# EAGLE schematic wordclock-r4-4x6 (EAGLE 5.11)
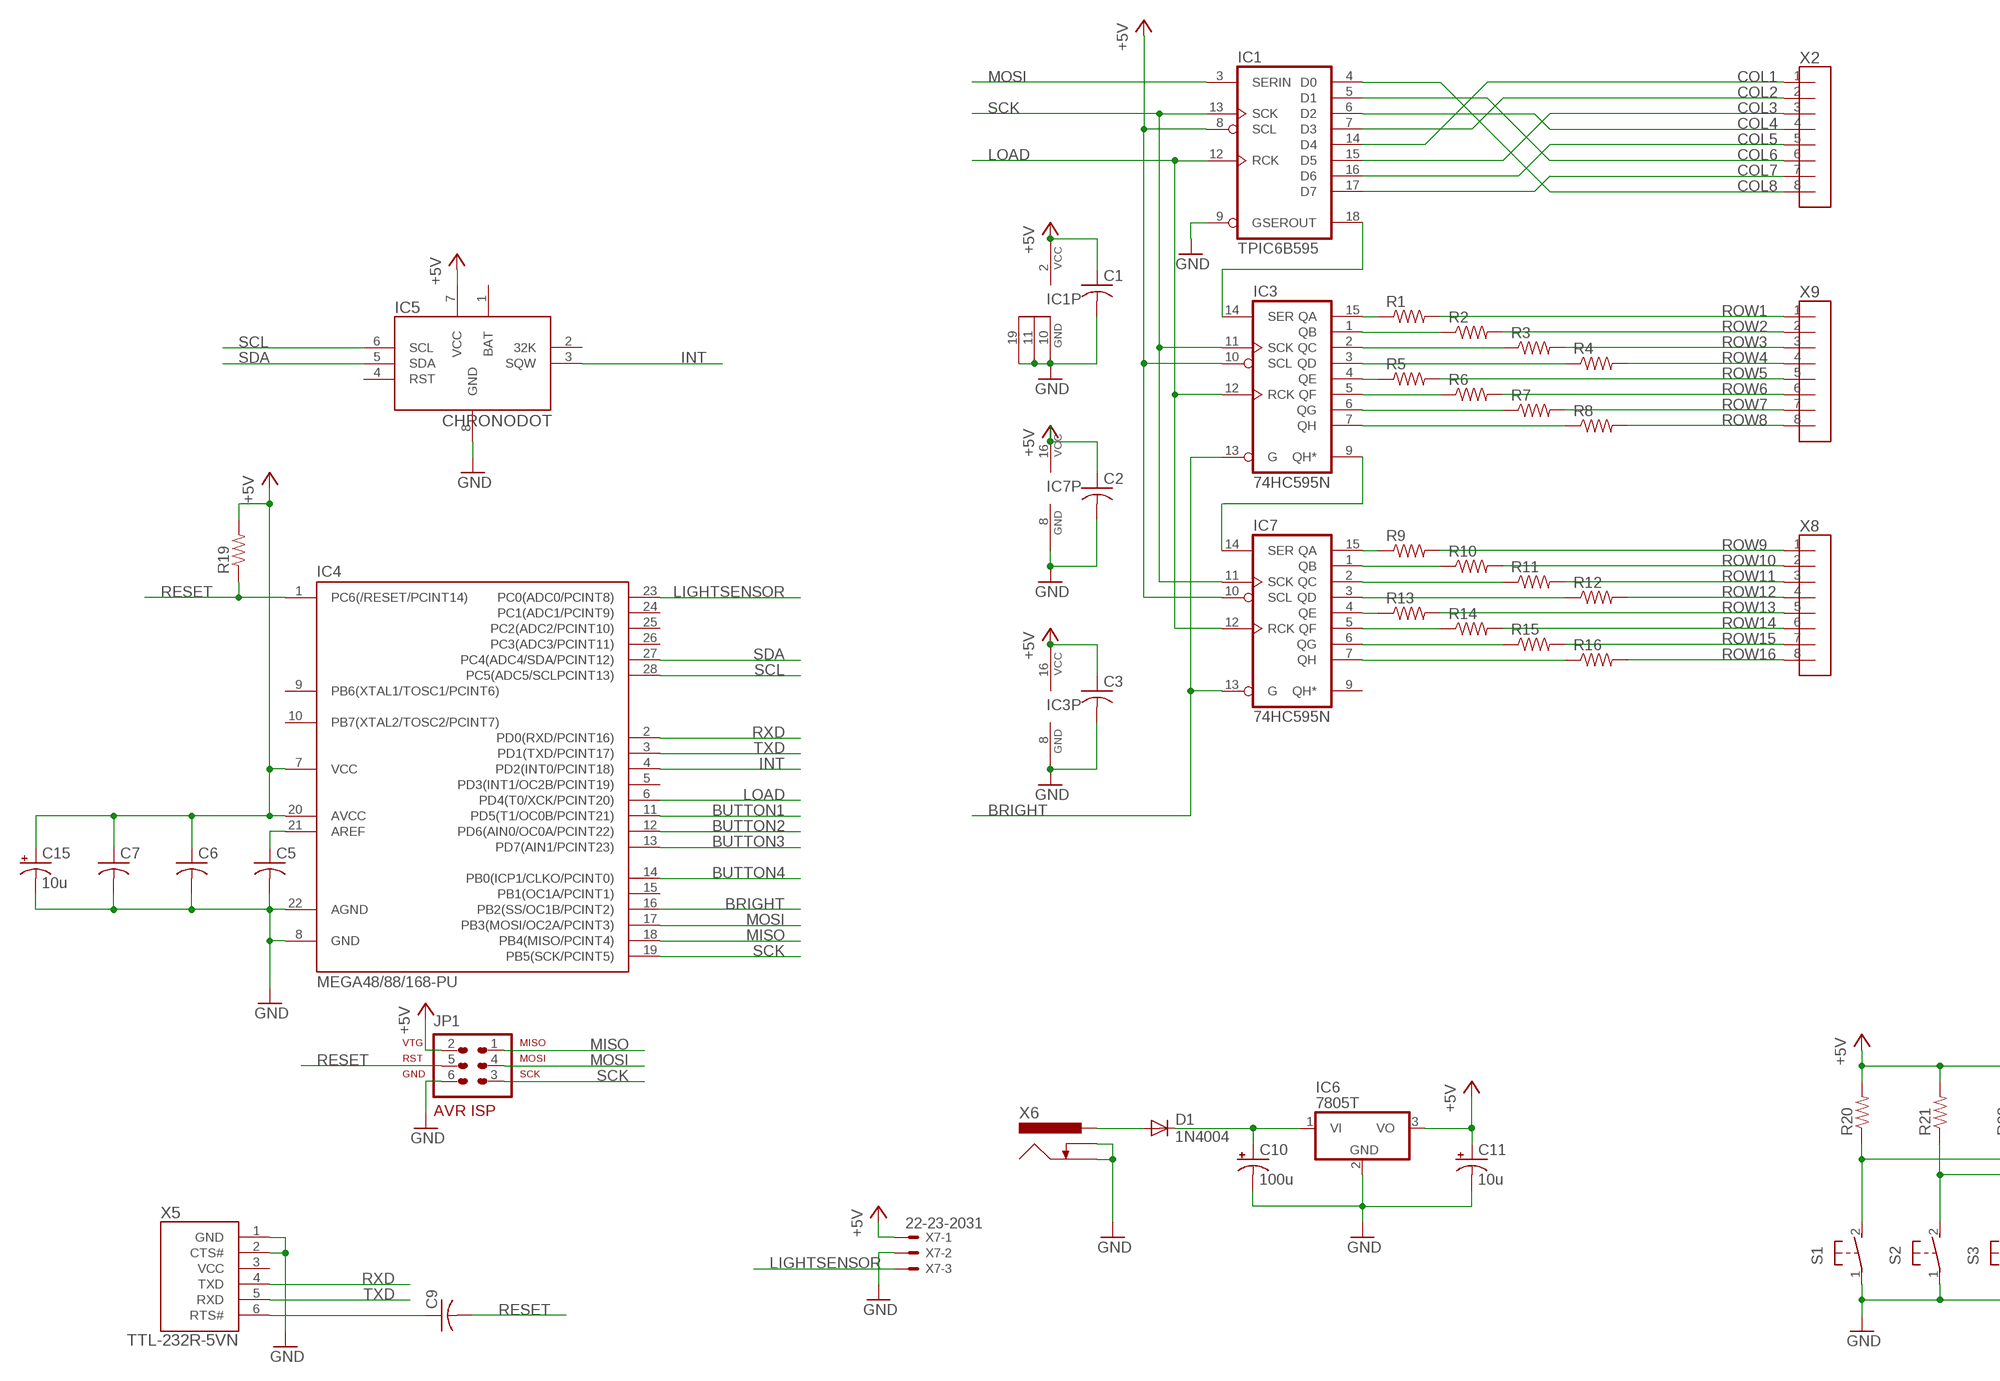
[diagram p0: schematic, sheet 1, part 1 of 2]
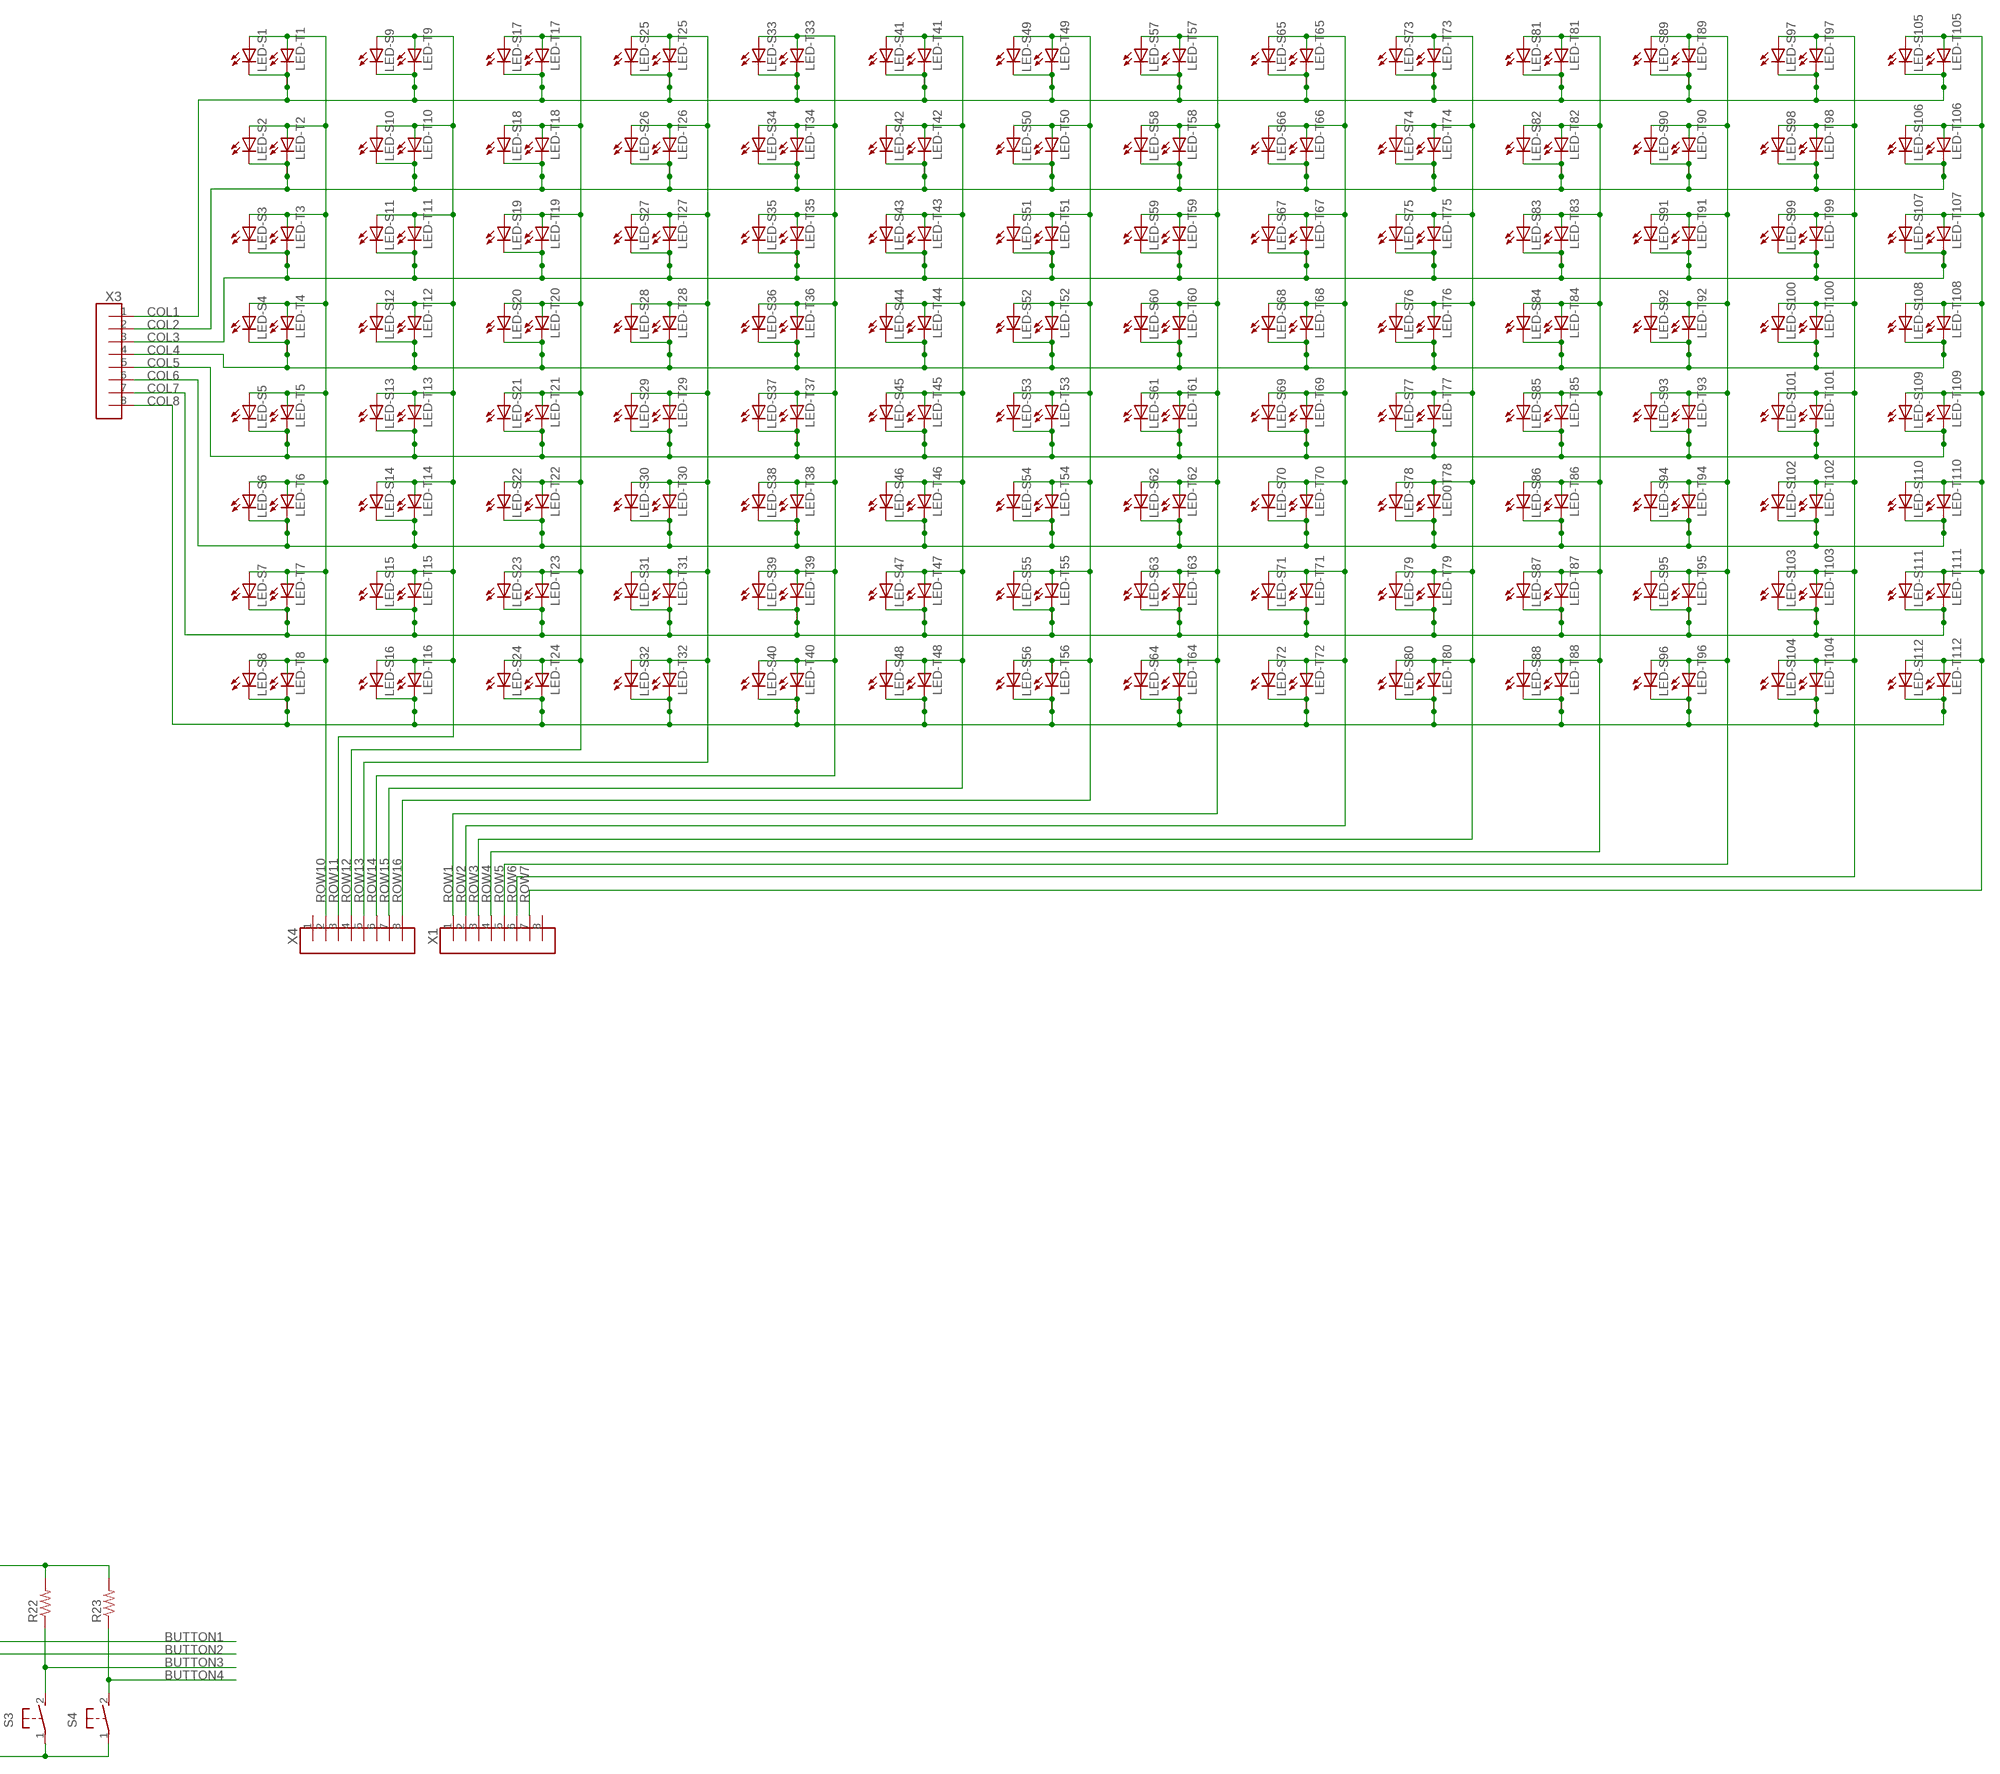
[diagram p1: schematic, sheet 1, part 2 of 2]

## Parts
C1  C-US050-025X075  [C050-025X075]
C2  C-US050-025X075  [C050-025X075]
C3  C-US050-025X075  [C050-025X075]
C5  C-US050-025X075  [C050-025X075]
C6  C-US050-025X075  [C050-025X075]
C7  C-US050-025X075  [C050-025X075]
C9  C-US050-025X075  [C050-025X075]
C10  100u  CPOL-USE3.5-8  [E3,5-8]
C11  10u  CPOL-USE2.5-6  [E2,5-6]
C15  10u  CPOL-USE2.5-6  [E2,5-6]
D1  1N4004  [DO41-10]
IC1  TPIC6B595  [DIL20]
IC3  74HC595N  74LS595N  [DIL16]
IC4  MEGA48/88/168-PU  [DIL28-3]
IC5  CHRONODOT  [CHRONODOT]
IC6  7805T  [TO220H]
IC7  74HC595N  74LS595N  [DIL16]
JP1  AVR-ISP-6  [AVR-ISP-6]
LED0T78  LED-2AC-SUPERFLUX  [SUPERFLUX-7.6X7.6]
LED-S1  LEDKA-3528ASYC  [KA-3528ASYC]
LED-S2  LEDKA-3528ASYC  [KA-3528ASYC]
LED-S3  LEDKA-3528ASYC  [KA-3528ASYC]
LED-S4  LEDKA-3528ASYC  [KA-3528ASYC]
LED-S5  LEDKA-3528ASYC  [KA-3528ASYC]
LED-S6  LEDKA-3528ASYC  [KA-3528ASYC]
LED-S7  LEDKA-3528ASYC  [KA-3528ASYC]
LED-S8  LEDKA-3528ASYC  [KA-3528ASYC]
LED-S9  LEDKA-3528ASYC  [KA-3528ASYC]
LED-S10  LEDKA-3528ASYC  [KA-3528ASYC]
LED-S11  LEDKA-3528ASYC  [KA-3528ASYC]
LED-S12  LEDKA-3528ASYC  [KA-3528ASYC]
LED-S13  LEDKA-3528ASYC  [KA-3528ASYC]
LED-S14  LEDKA-3528ASYC  [KA-3528ASYC]
LED-S15  LEDKA-3528ASYC  [KA-3528ASYC]
LED-S16  LEDKA-3528ASYC  [KA-3528ASYC]
LED-S17  LEDKA-3528ASYC  [KA-3528ASYC]
LED-S18  LEDKA-3528ASYC  [KA-3528ASYC]
LED-S19  LEDKA-3528ASYC  [KA-3528ASYC]
LED-S20  LEDKA-3528ASYC  [KA-3528ASYC]
LED-S21  LEDKA-3528ASYC  [KA-3528ASYC]
LED-S22  LEDKA-3528ASYC  [KA-3528ASYC]
LED-S23  LEDKA-3528ASYC  [KA-3528ASYC]
LED-S24  LEDKA-3528ASYC  [KA-3528ASYC]
LED-S25  LEDKA-3528ASYC  [KA-3528ASYC]
LED-S26  LEDKA-3528ASYC  [KA-3528ASYC]
LED-S27  LEDKA-3528ASYC  [KA-3528ASYC]
LED-S28  LEDKA-3528ASYC  [KA-3528ASYC]
LED-S29  LEDKA-3528ASYC  [KA-3528ASYC]
LED-S30  LEDKA-3528ASYC  [KA-3528ASYC]
LED-S31  LEDKA-3528ASYC  [KA-3528ASYC]
LED-S32  LEDKA-3528ASYC  [KA-3528ASYC]
LED-S33  LEDKA-3528ASYC  [KA-3528ASYC]
LED-S34  LEDKA-3528ASYC  [KA-3528ASYC]
LED-S35  LEDKA-3528ASYC  [KA-3528ASYC]
LED-S36  LEDKA-3528ASYC  [KA-3528ASYC]
LED-S37  LEDKA-3528ASYC  [KA-3528ASYC]
LED-S38  LEDKA-3528ASYC  [KA-3528ASYC]
LED-S39  LEDKA-3528ASYC  [KA-3528ASYC]
LED-S40  LEDKA-3528ASYC  [KA-3528ASYC]
LED-S41  LEDKA-3528ASYC  [KA-3528ASYC]
LED-S42  LEDKA-3528ASYC  [KA-3528ASYC]
LED-S43  LEDKA-3528ASYC  [KA-3528ASYC]
LED-S44  LEDKA-3528ASYC  [KA-3528ASYC]
LED-S45  LEDKA-3528ASYC  [KA-3528ASYC]
LED-S46  LEDKA-3528ASYC  [KA-3528ASYC]
LED-S47  LEDKA-3528ASYC  [KA-3528ASYC]
LED-S48  LEDKA-3528ASYC  [KA-3528ASYC]
LED-S49  LEDKA-3528ASYC  [KA-3528ASYC]
LED-S50  LEDKA-3528ASYC  [KA-3528ASYC]
LED-S51  LEDKA-3528ASYC  [KA-3528ASYC]
LED-S52  LEDKA-3528ASYC  [KA-3528ASYC]
LED-S53  LEDKA-3528ASYC  [KA-3528ASYC]
LED-S54  LEDKA-3528ASYC  [KA-3528ASYC]
LED-S55  LEDKA-3528ASYC  [KA-3528ASYC]
LED-S56  LEDKA-3528ASYC  [KA-3528ASYC]
LED-S57  LEDKA-3528ASYC  [KA-3528ASYC]
LED-S58  LEDKA-3528ASYC  [KA-3528ASYC]
LED-S59  LEDKA-3528ASYC  [KA-3528ASYC]
LED-S60  LEDKA-3528ASYC  [KA-3528ASYC]
LED-S61  LEDKA-3528ASYC  [KA-3528ASYC]
LED-S62  LEDKA-3528ASYC  [KA-3528ASYC]
LED-S63  LEDKA-3528ASYC  [KA-3528ASYC]
LED-S64  LEDKA-3528ASYC  [KA-3528ASYC]
LED-S65  LEDKA-3528ASYC  [KA-3528ASYC]
LED-S66  LEDKA-3528ASYC  [KA-3528ASYC]
LED-S67  LEDKA-3528ASYC  [KA-3528ASYC]
LED-S68  LEDKA-3528ASYC  [KA-3528ASYC]
LED-S69  LEDKA-3528ASYC  [KA-3528ASYC]
LED-S70  LEDKA-3528ASYC  [KA-3528ASYC]
LED-S71  LEDKA-3528ASYC  [KA-3528ASYC]
LED-S72  LEDKA-3528ASYC  [KA-3528ASYC]
LED-S73  LEDKA-3528ASYC  [KA-3528ASYC]
LED-S74  LEDKA-3528ASYC  [KA-3528ASYC]
LED-S75  LEDKA-3528ASYC  [KA-3528ASYC]
LED-S76  LEDKA-3528ASYC  [KA-3528ASYC]
LED-S77  LEDKA-3528ASYC  [KA-3528ASYC]
LED-S78  LEDKA-3528ASYC  [KA-3528ASYC]
LED-S79  LEDKA-3528ASYC  [KA-3528ASYC]
LED-S80  LEDKA-3528ASYC  [KA-3528ASYC]
LED-S81  LEDKA-3528ASYC  [KA-3528ASYC]
LED-S82  LEDKA-3528ASYC  [KA-3528ASYC]
LED-S83  LEDKA-3528ASYC  [KA-3528ASYC]
LED-S84  LEDKA-3528ASYC  [KA-3528ASYC]
LED-S85  LEDKA-3528ASYC  [KA-3528ASYC]
LED-S86  LEDKA-3528ASYC  [KA-3528ASYC]
LED-S87  LEDKA-3528ASYC  [KA-3528ASYC]
LED-S88  LEDKA-3528ASYC  [KA-3528ASYC]
LED-S89  LEDKA-3528ASYC  [KA-3528ASYC]
LED-S90  LEDKA-3528ASYC  [KA-3528ASYC]
LED-S91  LEDKA-3528ASYC  [KA-3528ASYC]
LED-S92  LEDKA-3528ASYC  [KA-3528ASYC]
LED-S93  LEDKA-3528ASYC  [KA-3528ASYC]
LED-S94  LEDKA-3528ASYC  [KA-3528ASYC]
LED-S95  LEDKA-3528ASYC  [KA-3528ASYC]
LED-S96  LEDKA-3528ASYC  [KA-3528ASYC]
LED-S97  LEDKA-3528ASYC  [KA-3528ASYC]
LED-S98  LEDKA-3528ASYC  [KA-3528ASYC]
LED-S99  LEDKA-3528ASYC  [KA-3528ASYC]
LED-S100  LEDKA-3528ASYC  [KA-3528ASYC]
LED-S101  LEDKA-3528ASYC  [KA-3528ASYC]
LED-S102  LEDKA-3528ASYC  [KA-3528ASYC]
LED-S103  LEDKA-3528ASYC  [KA-3528ASYC]
LED-S104  LEDKA-3528ASYC  [KA-3528ASYC]
LED-S105  LEDKA-3528ASYC  [KA-3528ASYC]
LED-S106  LEDKA-3528ASYC  [KA-3528ASYC]
LED-S107  LEDKA-3528ASYC  [KA-3528ASYC]
LED-S108  LEDKA-3528ASYC  [KA-3528ASYC]
LED-S109  LEDKA-3528ASYC  [KA-3528ASYC]
LED-S110  LEDKA-3528ASYC  [KA-3528ASYC]
LED-S111  LEDKA-3528ASYC  [KA-3528ASYC]
LED-S112  LEDKA-3528ASYC  [KA-3528ASYC]
LED-T1  LED-2AC-SUPERFLUX  [SUPERFLUX-7.6X7.6]
LED-T2  LED-2AC-SUPERFLUX  [SUPERFLUX-7.6X7.6]
LED-T3  LED-2AC-SUPERFLUX  [SUPERFLUX-7.6X7.6]
LED-T4  LED-2AC-SUPERFLUX  [SUPERFLUX-7.6X7.6]
LED-T5  LED-2AC-SUPERFLUX  [SUPERFLUX-7.6X7.6]
LED-T6  LED-2AC-SUPERFLUX  [SUPERFLUX-7.6X7.6]
LED-T7  LED-2AC-SUPERFLUX  [SUPERFLUX-7.6X7.6]
LED-T8  LED-2AC-SUPERFLUX  [SUPERFLUX-7.6X7.6]
LED-T9  LED-2AC-SUPERFLUX  [SUPERFLUX-7.6X7.6]
LED-T10  LED-2AC-SUPERFLUX  [SUPERFLUX-7.6X7.6]
LED-T11  LED-2AC-SUPERFLUX  [SUPERFLUX-7.6X7.6]
LED-T12  LED-2AC-SUPERFLUX  [SUPERFLUX-7.6X7.6]
LED-T13  LED-2AC-SUPERFLUX  [SUPERFLUX-7.6X7.6]
LED-T14  LED-2AC-SUPERFLUX  [SUPERFLUX-7.6X7.6]
LED-T15  LED-2AC-SUPERFLUX  [SUPERFLUX-7.6X7.6]
LED-T16  LED-2AC-SUPERFLUX  [SUPERFLUX-7.6X7.6]
LED-T17  LED-2AC-SUPERFLUX  [SUPERFLUX-7.6X7.6]
LED-T18  LED-2AC-SUPERFLUX  [SUPERFLUX-7.6X7.6]
LED-T19  LED-2AC-SUPERFLUX  [SUPERFLUX-7.6X7.6]
LED-T20  LED-2AC-SUPERFLUX  [SUPERFLUX-7.6X7.6]
LED-T21  LED-2AC-SUPERFLUX  [SUPERFLUX-7.6X7.6]
LED-T22  LED-2AC-SUPERFLUX  [SUPERFLUX-7.6X7.6]
LED-T23  LED-2AC-SUPERFLUX  [SUPERFLUX-7.6X7.6]
LED-T24  LED-2AC-SUPERFLUX  [SUPERFLUX-7.6X7.6]
LED-T25  LED-2AC-SUPERFLUX  [SUPERFLUX-7.6X7.6]
LED-T26  LED-2AC-SUPERFLUX  [SUPERFLUX-7.6X7.6]
LED-T27  LED-2AC-SUPERFLUX  [SUPERFLUX-7.6X7.6]
LED-T28  LED-2AC-SUPERFLUX  [SUPERFLUX-7.6X7.6]
LED-T29  LED-2AC-SUPERFLUX  [SUPERFLUX-7.6X7.6]
LED-T30  LED-2AC-SUPERFLUX  [SUPERFLUX-7.6X7.6]
LED-T31  LED-2AC-SUPERFLUX  [SUPERFLUX-7.6X7.6]
LED-T32  LED-2AC-SUPERFLUX  [SUPERFLUX-7.6X7.6]
LED-T33  LED-2AC-SUPERFLUX  [SUPERFLUX-7.6X7.6]
LED-T34  LED-2AC-SUPERFLUX  [SUPERFLUX-7.6X7.6]
LED-T35  LED-2AC-SUPERFLUX  [SUPERFLUX-7.6X7.6]
LED-T36  LED-2AC-SUPERFLUX  [SUPERFLUX-7.6X7.6]
LED-T37  LED-2AC-SUPERFLUX  [SUPERFLUX-7.6X7.6]
LED-T38  LED-2AC-SUPERFLUX  [SUPERFLUX-7.6X7.6]
LED-T39  LED-2AC-SUPERFLUX  [SUPERFLUX-7.6X7.6]
LED-T40  LED-2AC-SUPERFLUX  [SUPERFLUX-7.6X7.6]
LED-T41  LED-2AC-SUPERFLUX  [SUPERFLUX-7.6X7.6]
LED-T42  LED-2AC-SUPERFLUX  [SUPERFLUX-7.6X7.6]
LED-T43  LED-2AC-SUPERFLUX  [SUPERFLUX-7.6X7.6]
LED-T44  LED-2AC-SUPERFLUX  [SUPERFLUX-7.6X7.6]
LED-T45  LED-2AC-SUPERFLUX  [SUPERFLUX-7.6X7.6]
LED-T46  LED-2AC-SUPERFLUX  [SUPERFLUX-7.6X7.6]
LED-T47  LED-2AC-SUPERFLUX  [SUPERFLUX-7.6X7.6]
LED-T48  LED-2AC-SUPERFLUX  [SUPERFLUX-7.6X7.6]
LED-T49  LED-2AC-SUPERFLUX  [SUPERFLUX-7.6X7.6]
LED-T50  LED-2AC-SUPERFLUX  [SUPERFLUX-7.6X7.6]
LED-T51  LED-2AC-SUPERFLUX  [SUPERFLUX-7.6X7.6]
LED-T52  LED-2AC-SUPERFLUX  [SUPERFLUX-7.6X7.6]
LED-T53  LED-2AC-SUPERFLUX  [SUPERFLUX-7.6X7.6]
LED-T54  LED-2AC-SUPERFLUX  [SUPERFLUX-7.6X7.6]
LED-T55  LED-2AC-SUPERFLUX  [SUPERFLUX-7.6X7.6]
LED-T56  LED-2AC-SUPERFLUX  [SUPERFLUX-7.6X7.6]
LED-T57  LED-2AC-SUPERFLUX  [SUPERFLUX-7.6X7.6]
LED-T58  LED-2AC-SUPERFLUX  [SUPERFLUX-7.6X7.6]
LED-T59  LED-2AC-SUPERFLUX  [SUPERFLUX-7.6X7.6]
LED-T60  LED-2AC-SUPERFLUX  [SUPERFLUX-7.6X7.6]
LED-T61  LED-2AC-SUPERFLUX  [SUPERFLUX-7.6X7.6]
LED-T62  LED-2AC-SUPERFLUX  [SUPERFLUX-7.6X7.6]
LED-T63  LED-2AC-SUPERFLUX  [SUPERFLUX-7.6X7.6]
LED-T64  LED-2AC-SUPERFLUX  [SUPERFLUX-7.6X7.6]
LED-T65  LED-2AC-SUPERFLUX  [SUPERFLUX-7.6X7.6]
LED-T66  LED-2AC-SUPERFLUX  [SUPERFLUX-7.6X7.6]
LED-T67  LED-2AC-SUPERFLUX  [SUPERFLUX-7.6X7.6]
LED-T68  LED-2AC-SUPERFLUX  [SUPERFLUX-7.6X7.6]
LED-T69  LED-2AC-SUPERFLUX  [SUPERFLUX-7.6X7.6]
LED-T70  LED-2AC-SUPERFLUX  [SUPERFLUX-7.6X7.6]
LED-T71  LED-2AC-SUPERFLUX  [SUPERFLUX-7.6X7.6]
LED-T72  LED-2AC-SUPERFLUX  [SUPERFLUX-7.6X7.6]
LED-T73  LED-2AC-SUPERFLUX  [SUPERFLUX-7.6X7.6]
LED-T74  LED-2AC-SUPERFLUX  [SUPERFLUX-7.6X7.6]
LED-T75  LED-2AC-SUPERFLUX  [SUPERFLUX-7.6X7.6]
LED-T76  LED-2AC-SUPERFLUX  [SUPERFLUX-7.6X7.6]
LED-T77  LED-2AC-SUPERFLUX  [SUPERFLUX-7.6X7.6]
LED-T79  LED-2AC-SUPERFLUX  [SUPERFLUX-7.6X7.6]
LED-T80  LED-2AC-SUPERFLUX  [SUPERFLUX-7.6X7.6]
LED-T81  LED-2AC-SUPERFLUX  [SUPERFLUX-7.6X7.6]
LED-T82  LED-2AC-SUPERFLUX  [SUPERFLUX-7.6X7.6]
LED-T83  LED-2AC-SUPERFLUX  [SUPERFLUX-7.6X7.6]
LED-T84  LED-2AC-SUPERFLUX  [SUPERFLUX-7.6X7.6]
LED-T85  LED-2AC-SUPERFLUX  [SUPERFLUX-7.6X7.6]
LED-T86  LED-2AC-SUPERFLUX  [SUPERFLUX-7.6X7.6]
LED-T87  LED-2AC-SUPERFLUX  [SUPERFLUX-7.6X7.6]
LED-T88  LED-2AC-SUPERFLUX  [SUPERFLUX-7.6X7.6]
LED-T89  LED-2AC-SUPERFLUX  [SUPERFLUX-7.6X7.6]
LED-T90  LED-2AC-SUPERFLUX  [SUPERFLUX-7.6X7.6]
LED-T91  LED-2AC-SUPERFLUX  [SUPERFLUX-7.6X7.6]
LED-T92  LED-2AC-SUPERFLUX  [SUPERFLUX-7.6X7.6]
LED-T93  LED-2AC-SUPERFLUX  [SUPERFLUX-7.6X7.6]
LED-T94  LED-2AC-SUPERFLUX  [SUPERFLUX-7.6X7.6]
LED-T95  LED-2AC-SUPERFLUX  [SUPERFLUX-7.6X7.6]
LED-T96  LED-2AC-SUPERFLUX  [SUPERFLUX-7.6X7.6]
LED-T97  LED-2AC-SUPERFLUX  [SUPERFLUX-7.6X7.6]
LED-T98  LED-2AC-SUPERFLUX  [SUPERFLUX-7.6X7.6]
LED-T99  LED-2AC-SUPERFLUX  [SUPERFLUX-7.6X7.6]
LED-T100  LED-2AC-SUPERFLUX  [SUPERFLUX-7.6X7.6]
LED-T101  LED-2AC-SUPERFLUX  [SUPERFLUX-7.6X7.6]
LED-T102  LED-2AC-SUPERFLUX  [SUPERFLUX-7.6X7.6]
LED-T103  LED-2AC-SUPERFLUX  [SUPERFLUX-7.6X7.6]
LED-T104  LED-2AC-SUPERFLUX  [SUPERFLUX-7.6X7.6]
LED-T105  LED-2AC-SUPERFLUX  [SUPERFLUX-7.6X7.6]
LED-T106  LED-2AC-SUPERFLUX  [SUPERFLUX-7.6X7.6]
LED-T107  LED-2AC-SUPERFLUX  [SUPERFLUX-7.6X7.6]
LED-T108  LED-2AC-SUPERFLUX  [SUPERFLUX-7.6X7.6]
LED-T109  LED-2AC-SUPERFLUX  [SUPERFLUX-7.6X7.6]
LED-T110  LED-2AC-SUPERFLUX  [SUPERFLUX-7.6X7.6]
LED-T111  LED-2AC-SUPERFLUX  [SUPERFLUX-7.6X7.6]
LED-T112  LED-2AC-SUPERFLUX  [SUPERFLUX-7.6X7.6]
R1  R-US_0207/2V  [0207/2V]
R2  R-US_0207/2V  [0207/2V]
R3  R-US_0207/2V  [0207/2V]
R4  R-US_0207/2V  [0207/2V]
R5  R-US_0207/2V  [0207/2V]
R6  R-US_0207/2V  [0207/2V]
R7  R-US_0207/2V  [0207/2V]
R8  R-US_0207/2V  [0207/2V]
R9  R-US_0207/2V  [0207/2V]
R10  R-US_0207/2V  [0207/2V]
R11  R-US_0207/2V  [0207/2V]
R12  R-US_0207/2V  [0207/2V]
R13  R-US_0207/2V  [0207/2V]
R14  R-US_0207/2V  [0207/2V]
R15  R-US_0207/2V  [0207/2V]
R16  R-US_0207/2V  [0207/2V]
R19  R-US_0207/5V  [0207/5V]
R20  R-US_0207/5V  [0207/5V]
R21  R-US_0207/5V  [0207/5V]
R22  R-US_0207/5V  [0207/5V]
R23  R-US_0207/5V  [0207/5V]
S1  31-XX  [B3F-31XX]
S2  31-XX  [B3F-31XX]
S3  31-XX  [B3F-31XX]
S4  31-XX  [B3F-31XX]
X1  M08-100MIL  [100MIL-8]
X2  M08-100MIL  [100MIL-8]
X3  M08-100MIL  [100MIL-8]
X4  M08-100MIL  [100MIL-8]
X5  TTL-232R-5VN  [USBCABLE-0.100-NOLBL]
X6  PJ-002B  [PJ-002]
X7  22-23-2031  [22-23-2031]
X8  M08-100MIL  [100MIL-8]
X9  M08-100MIL  [100MIL-8]

## Nets
+5V: C1.1 C2.1 C3.1 C6.1 C7.1 C11.+ C15.+ IC1.2(VCC) IC1.8(SCL) IC3.10(SCL) IC3.16(VCC) IC4.7(VCC) IC4.20(AVCC) IC5.7(VCC) IC6.3(VO) IC7.10(SCL) IC7.16(VCC) JP1.2 R19.2 R20.2 R21.2 R22.2 R23.2 X7.1
BRIGHT: IC3.13(G) IC4.16(PB2(SS/OC1B/PCINT2)) IC7.13(G)
BUTTON1: IC4.11(PD5(T1/OC0B/PCINT21)) R20.1 S1.2(S)
BUTTON2: IC4.12(PD6(AIN0/OC0A/PCINT22)) R21.1 S2.2(S)
BUTTON3: IC4.13(PD7(AIN1/PCINT23)) R22.1 S3.2(S)
BUTTON4: IC4.14(PB0(ICP1/CLKO/PCINT0)) R23.1 S4.2(S)
COL1: IC1.14(D4) LED-S1.C LED-S9.C LED-S17.C LED-S25.C LED-S33.C LED-S41.C LED-S49.C LED-S57.C LED-S65.C LED-S73.C LED-S81.C LED-S89.C LED-S97.C LED-S105.C LED-T1.1(C) LED-T1.3(C) LED-T9.1(C) LED-T9.3(C) LED-T17.1(C) LED-T17.3(C) LED-T25.1(C) LED-T25.3(C) LED-T33.1(C) LED-T33.3(C) LED-T41.1(C) LED-T41.3(C) LED-T49.1(C) LED-T49.3(C) LED-T57.1(C) LED-T57.3(C) LED-T65.1(C) LED-T65.3(C) LED-T73.1(C) LED-T73.3(C) LED-T81.1(C) LED-T81.3(C) LED-T89.1(C) LED-T89.3(C) LED-T97.1(C) LED-T97.3(C) LED-T105.1(C) LED-T105.3(C) X2.1 X3.1
COL2: IC1.7(D3) LED-S2.C LED-S10.C LED-S18.C LED-S26.C LED-S34.C LED-S42.C LED-S50.C LED-S58.C LED-S66.C LED-S74.C LED-S82.C LED-S90.C LED-S98.C LED-S106.C LED-T2.1(C) LED-T2.3(C) LED-T10.1(C) LED-T10.3(C) LED-T18.1(C) LED-T18.3(C) LED-T26.1(C) LED-T26.3(C) LED-T34.1(C) LED-T34.3(C) LED-T42.1(C) LED-T42.3(C) LED-T50.1(C) LED-T50.3(C) LED-T58.1(C) LED-T58.3(C) LED-T66.1(C) LED-T66.3(C) LED-T74.1(C) LED-T74.3(C) LED-T82.1(C) LED-T82.3(C) LED-T90.1(C) LED-T90.3(C) LED-T98.1(C) LED-T98.3(C) LED-T106.1(C) LED-T106.3(C) X2.2 X3.2
COL3: IC1.15(D5) LED-S3.C LED-S11.C LED-S19.C LED-S27.C LED-S35.C LED-S43.C LED-S51.C LED-S59.C LED-S67.C LED-S75.C LED-S83.C LED-S91.C LED-S99.C LED-S107.C LED-T3.1(C) LED-T3.3(C) LED-T11.1(C) LED-T11.3(C) LED-T19.1(C) LED-T19.3(C) LED-T27.1(C) LED-T27.3(C) LED-T35.1(C) LED-T35.3(C) LED-T43.1(C) LED-T43.3(C) LED-T51.1(C) LED-T51.3(C) LED-T59.1(C) LED-T59.3(C) LED-T67.1(C) LED-T67.3(C) LED-T75.1(C) LED-T75.3(C) LED-T83.1(C) LED-T83.3(C) LED-T91.1(C) LED-T91.3(C) LED-T99.1(C) LED-T99.3(C) LED-T107.1(C) LED-T107.3(C) X2.3 X3.3
COL4: IC1.6(D2) LED-S4.C LED-S12.C LED-S20.C LED-S28.C LED-S36.C LED-S44.C LED-S52.C LED-S60.C LED-S68.C LED-S76.C LED-S84.C LED-S92.C LED-S100.C LED-S108.C LED-T4.1(C) LED-T4.3(C) LED-T12.1(C) LED-T12.3(C) LED-T20.1(C) LED-T20.3(C) LED-T28.1(C) LED-T28.3(C) LED-T36.1(C) LED-T36.3(C) LED-T44.1(C) LED-T44.3(C) LED-T52.1(C) LED-T52.3(C) LED-T60.1(C) LED-T60.3(C) LED-T68.1(C) LED-T68.3(C) LED-T76.1(C) LED-T76.3(C) LED-T84.1(C) LED-T84.3(C) LED-T92.1(C) LED-T92.3(C) LED-T100.1(C) LED-T100.3(C) LED-T108.1(C) LED-T108.3(C) X2.4 X3.4
COL5: IC1.16(D6) LED-S5.C LED-S13.C LED-S21.C LED-S29.C LED-S37.C LED-S45.C LED-S53.C LED-S61.C LED-S69.C LED-S77.C LED-S85.C LED-S93.C LED-S101.C LED-S109.C LED-T5.1(C) LED-T5.3(C) LED-T13.1(C) LED-T13.3(C) LED-T21.1(C) LED-T21.3(C) LED-T29.1(C) LED-T29.3(C) LED-T37.1(C) LED-T37.3(C) LED-T45.1(C) LED-T45.3(C) LED-T53.1(C) LED-T53.3(C) LED-T61.1(C) LED-T61.3(C) LED-T69.1(C) LED-T69.3(C) LED-T77.1(C) LED-T77.3(C) LED-T85.1(C) LED-T85.3(C) LED-T93.1(C) LED-T93.3(C) LED-T101.1(C) LED-T101.3(C) LED-T109.1(C) LED-T109.3(C) X2.5 X3.5
COL6: IC1.5(D1) LED0T78.1(C) LED0T78.3(C) LED-S6.C LED-S14.C LED-S22.C LED-S30.C LED-S38.C LED-S46.C LED-S54.C LED-S62.C LED-S70.C LED-S78.C LED-S86.C LED-S94.C LED-S102.C LED-S110.C LED-T6.1(C) LED-T6.3(C) LED-T14.1(C) LED-T14.3(C) LED-T22.1(C) LED-T22.3(C) LED-T30.1(C) LED-T30.3(C) LED-T38.1(C) LED-T38.3(C) LED-T46.1(C) LED-T46.3(C) LED-T54.1(C) LED-T54.3(C) LED-T62.1(C) LED-T62.3(C) LED-T70.1(C) LED-T70.3(C) LED-T86.1(C) LED-T86.3(C) LED-T94.1(C) LED-T94.3(C) LED-T102.1(C) LED-T102.3(C) LED-T110.1(C) LED-T110.3(C) X2.6 X3.6
COL7: IC1.17(D7) LED-S7.C LED-S15.C LED-S23.C LED-S31.C LED-S39.C LED-S47.C LED-S55.C LED-S63.C LED-S71.C LED-S79.C LED-S87.C LED-S95.C LED-S103.C LED-S111.C LED-T7.1(C) LED-T7.3(C) LED-T15.1(C) LED-T15.3(C) LED-T23.1(C) LED-T23.3(C) LED-T31.1(C) LED-T31.3(C) LED-T39.1(C) LED-T39.3(C) LED-T47.1(C) LED-T47.3(C) LED-T55.1(C) LED-T55.3(C) LED-T63.1(C) LED-T63.3(C) LED-T71.1(C) LED-T71.3(C) LED-T79.1(C) LED-T79.3(C) LED-T87.1(C) LED-T87.3(C) LED-T95.1(C) LED-T95.3(C) LED-T103.1(C) LED-T103.3(C) LED-T111.1(C) LED-T111.3(C) X2.7 X3.7
COL8: IC1.4(D0) LED-S8.C LED-S16.C LED-S24.C LED-S32.C LED-S40.C LED-S48.C LED-S56.C LED-S64.C LED-S72.C LED-S80.C LED-S88.C LED-S96.C LED-S104.C LED-S112.C LED-T8.1(C) LED-T8.3(C) LED-T16.1(C) LED-T16.3(C) LED-T24.1(C) LED-T24.3(C) LED-T32.1(C) LED-T32.3(C) LED-T40.1(C) LED-T40.3(C) LED-T48.1(C) LED-T48.3(C) LED-T56.1(C) LED-T56.3(C) LED-T64.1(C) LED-T64.3(C) LED-T72.1(C) LED-T72.3(C) LED-T80.1(C) LED-T80.3(C) LED-T88.1(C) LED-T88.3(C) LED-T96.1(C) LED-T96.3(C) LED-T104.1(C) LED-T104.3(C) LED-T112.1(C) LED-T112.3(C) X2.8 X3.8
GND: C1.2 C2.2 C3.2 C5.2 C6.2 C7.2 C10.- C11.- C15.- IC1.9(G) IC1.10(GND) IC1.11(GND1) IC1.19(GND2) IC3.8(GND) IC4.8(GND) IC4.22(AGND) IC5.8(GND) IC6.2(GND) IC7.8(GND) JP1.6 S1.1(P) S2.1(P) S3.1(P) S4.1(P) X5.1(GND) X5.2(CTS#) X6.2 X6.3 X7.2
INT: IC4.4(PD2(INT0/PCINT18)) IC5.3(SQW)
LIGHTSENSOR: IC4.23(PC0(ADC0/PCINT8)) X7.3
LOAD: IC1.12(RCK) IC3.12(RCK) IC4.6(PD4(T0/XCK/PCINT20)) IC7.12(RCK)
MISO: IC4.18(PB4(MISO/PCINT4)) JP1.1
MOSI: IC1.3(SERIN) IC4.17(PB3(MOSI/OC2A/PCINT3)) JP1.4
N$2: IC7.15(QA) R9.1
N$3: IC7.1(QB) R10.1
N$4: IC7.2(QC) R11.1
N$5: IC1.18(SEROUT) IC3.14(SER)
N$6: IC3.9(QH*) IC7.14(SER)
N$7: IC3.15(QA) R1.1
N$8: IC3.1(QB) R2.1
N$9: IC3.2(QC) R3.1
N$10: IC3.3(QD) R4.1
N$11: IC3.4(QE) R5.1
N$12: IC3.5(QF) R6.1
N$13: IC3.6(QG) R7.1
N$14: IC3.7(QH) R8.1
N$15: C9.1 X5.6(RTS#)
N$16: IC7.3(QD) R12.1
N$17: IC7.4(QE) R13.1
N$18: IC7.5(QF) R14.1
N$19: IC7.6(QG) R15.1
N$20: IC7.7(QH) R16.1
N$54: C5.1 IC4.21(AREF)
N$56: D1.A X6.1
N$57: C10.+ D1.C IC6.1(VI)
RESET: C9.2 IC4.1(PC6(/RESET/PCINT14)) JP1.5 R19.1
ROW1: LED-S57.A LED-S58.A LED-S59.A LED-S60.A LED-S61.A LED-S62.A LED-S63.A LED-S64.A LED-T57.2(A) LED-T57.4(A) LED-T58.2(A) LED-T58.4(A) LED-T59.2(A) LED-T59.4(A) LED-T60.2(A) LED-T60.4(A) LED-T61.2(A) LED-T61.4(A) LED-T62.2(A) LED-T62.4(A) LED-T63.2(A) LED-T63.4(A) LED-T64.2(A) LED-T64.4(A) R1.2 X1.1 X9.1
ROW2: LED-S65.A LED-S66.A LED-S67.A LED-S68.A LED-S69.A LED-S70.A LED-S71.A LED-S72.A LED-T65.2(A) LED-T65.4(A) LED-T66.2(A) LED-T66.4(A) LED-T67.2(A) LED-T67.4(A) LED-T68.2(A) LED-T68.4(A) LED-T69.2(A) LED-T69.4(A) LED-T70.2(A) LED-T70.4(A) LED-T71.2(A) LED-T71.4(A) LED-T72.2(A) LED-T72.4(A) R2.2 X1.2 X9.2
ROW3: LED0T78.2(A) LED0T78.4(A) LED-S73.A LED-S74.A LED-S75.A LED-S76.A LED-S77.A LED-S78.A LED-S79.A LED-S80.A LED-T73.2(A) LED-T73.4(A) LED-T74.2(A) LED-T74.4(A) LED-T75.2(A) LED-T75.4(A) LED-T76.2(A) LED-T76.4(A) LED-T77.2(A) LED-T77.4(A) LED-T79.2(A) LED-T79.4(A) LED-T80.2(A) LED-T80.4(A) R3.2 X1.3 X9.3
ROW4: LED-S81.A LED-S82.A LED-S83.A LED-S84.A LED-S85.A LED-S86.A LED-S87.A LED-S88.A LED-T81.2(A) LED-T81.4(A) LED-T82.2(A) LED-T82.4(A) LED-T83.2(A) LED-T83.4(A) LED-T84.2(A) LED-T84.4(A) LED-T85.2(A) LED-T85.4(A) LED-T86.2(A) LED-T86.4(A) LED-T87.2(A) LED-T87.4(A) LED-T88.2(A) LED-T88.4(A) R4.2 X1.4 X9.4
ROW5: LED-S89.A LED-S90.A LED-S91.A LED-S92.A LED-S93.A LED-S94.A LED-S95.A LED-S96.A LED-T89.2(A) LED-T89.4(A) LED-T90.2(A) LED-T90.4(A) LED-T91.2(A) LED-T91.4(A) LED-T92.2(A) LED-T92.4(A) LED-T93.2(A) LED-T93.4(A) LED-T94.2(A) LED-T94.4(A) LED-T95.2(A) LED-T95.4(A) LED-T96.2(A) LED-T96.4(A) R5.2 X1.5 X9.5
ROW6: LED-S97.A LED-S98.A LED-S99.A LED-S100.A LED-S101.A LED-S102.A LED-S103.A LED-S104.A LED-T97.2(A) LED-T97.4(A) LED-T98.2(A) LED-T98.4(A) LED-T99.2(A) LED-T99.4(A) LED-T100.2(A) LED-T100.4(A) LED-T101.2(A) LED-T101.4(A) LED-T102.2(A) LED-T102.4(A) LED-T103.2(A) LED-T103.4(A) LED-T104.2(A) LED-T104.4(A) R6.2 X1.6 X9.6
ROW7: LED-S105.A LED-S106.A LED-S107.A LED-S108.A LED-S109.A LED-S110.A LED-S111.A LED-S112.A LED-T105.2(A) LED-T105.4(A) LED-T106.2(A) LED-T106.4(A) LED-T107.2(A) LED-T107.4(A) LED-T108.2(A) LED-T108.4(A) LED-T109.2(A) LED-T109.4(A) LED-T110.2(A) LED-T110.4(A) LED-T111.2(A) LED-T111.4(A) LED-T112.2(A) LED-T112.4(A) R7.2 X1.7 X9.7
ROW8: R8.2 X9.8
ROW9: R9.2 X8.1
ROW10: LED-S1.A LED-S2.A LED-S3.A LED-S4.A LED-S5.A LED-S6.A LED-S7.A LED-S8.A LED-T1.2(A) LED-T1.4(A) LED-T2.2(A) LED-T2.4(A) LED-T3.2(A) LED-T3.4(A) LED-T4.2(A) LED-T4.4(A) LED-T5.2(A) LED-T5.4(A) LED-T6.2(A) LED-T6.4(A) LED-T7.2(A) LED-T7.4(A) LED-T8.2(A) LED-T8.4(A) R10.2 X4.2 X8.2
ROW11: LED-S9.A LED-S10.A LED-S11.A LED-S12.A LED-S13.A LED-S14.A LED-S15.A LED-S16.A LED-T9.2(A) LED-T9.4(A) LED-T10.2(A) LED-T10.4(A) LED-T11.2(A) LED-T11.4(A) LED-T12.2(A) LED-T12.4(A) LED-T13.2(A) LED-T13.4(A) LED-T14.2(A) LED-T14.4(A) LED-T15.2(A) LED-T15.4(A) LED-T16.2(A) LED-T16.4(A) R11.2 X4.3 X8.3
ROW12: LED-S17.A LED-S18.A LED-S19.A LED-S20.A LED-S21.A LED-S22.A LED-S23.A LED-S24.A LED-T17.2(A) LED-T17.4(A) LED-T18.2(A) LED-T18.4(A) LED-T19.2(A) LED-T19.4(A) LED-T20.2(A) LED-T20.4(A) LED-T21.2(A) LED-T21.4(A) LED-T22.2(A) LED-T22.4(A) LED-T23.2(A) LED-T23.4(A) LED-T24.2(A) LED-T24.4(A) R12.2 X4.4 X8.4
ROW13: LED-S25.A LED-S26.A LED-S27.A LED-S28.A LED-S29.A LED-S30.A LED-S31.A LED-S32.A LED-T25.2(A) LED-T25.4(A) LED-T26.2(A) LED-T26.4(A) LED-T27.2(A) LED-T27.4(A) LED-T28.2(A) LED-T28.4(A) LED-T29.2(A) LED-T29.4(A) LED-T30.2(A) LED-T30.4(A) LED-T31.2(A) LED-T31.4(A) LED-T32.2(A) LED-T32.4(A) R13.2 X4.5 X8.5
ROW14: LED-S33.A LED-S34.A LED-S35.A LED-S36.A LED-S37.A LED-S38.A LED-S39.A LED-S40.A LED-T33.2(A) LED-T33.4(A) LED-T34.2(A) LED-T34.4(A) LED-T35.2(A) LED-T35.4(A) LED-T36.2(A) LED-T36.4(A) LED-T37.2(A) LED-T37.4(A) LED-T38.2(A) LED-T38.4(A) LED-T39.2(A) LED-T39.4(A) LED-T40.2(A) LED-T40.4(A) R14.2 X4.6 X8.6
ROW15: LED-S41.A LED-S42.A LED-S43.A LED-S44.A LED-S45.A LED-S46.A LED-S47.A LED-S48.A LED-T41.2(A) LED-T41.4(A) LED-T42.2(A) LED-T42.4(A) LED-T43.2(A) LED-T43.4(A) LED-T44.2(A) LED-T44.4(A) LED-T45.2(A) LED-T45.4(A) LED-T46.2(A) LED-T46.4(A) LED-T47.2(A) LED-T47.4(A) LED-T48.2(A) LED-T48.4(A) R15.2 X4.7 X8.7
ROW16: LED-S49.A LED-S50.A LED-S51.A LED-S52.A LED-S53.A LED-S54.A LED-S55.A LED-S56.A LED-T49.2(A) LED-T49.4(A) LED-T50.2(A) LED-T50.4(A) LED-T51.2(A) LED-T51.4(A) LED-T52.2(A) LED-T52.4(A) LED-T53.2(A) LED-T53.4(A) LED-T54.2(A) LED-T54.4(A) LED-T55.2(A) LED-T55.4(A) LED-T56.2(A) LED-T56.4(A) R16.2 X4.8 X8.8
RXD: IC4.2(PD0(RXD/PCINT16)) X5.4(TXD)
SCK: IC1.13(SCK) IC3.11(SCK) IC4.19(PB5(SCK/PCINT5)) IC7.11(SCK) JP1.3
SCL: IC4.28(PC5(ADC5/SCLPCINT13)) IC5.6(SCL)
SDA: IC4.27(PC4(ADC4/SDA/PCINT12)) IC5.5(SDA)
TXD: IC4.3(PD1(TXD/PCINT17)) X5.5(RXD)
Unconnected: IC4.5(PD3(INT1/OC2B/PCINT19)) IC4.9(PB6(XTAL1/TOSC1/PCINT6)) IC4.10(PB7(XTAL2/TOSC2/PCINT7)) IC4.15(PB1(OC1A/PCINT1)) IC4.24(PC1(ADC1/PCINT9)) IC4.25(PC2(ADC2/PCINT10)) IC4.26(PC3(ADC3/PCINT11)) IC5.1(BAT) IC5.2(32K) IC5.4(RST) IC7.9(QH*) X1.8 X4.1 X5.3(VCC)

## Library data of the parts
C1-C3 C5-C7 C9 = rcl:C-US: CAPACITOR, American symbol
C10 C11 C15 = rcl:CPOL-US: POLARIZED CAPACITOR, American symbol
D1 = diode:1N4004: DIODE general purpose rectifier, 1 A
IC1 = rbg-ti-powerlogic:TPIC6B595: 8-bit SHIFT REGISTER, output latch, open collector
IC3 IC7 = 74xx-us:74*595: 8-bit SHIFT REGISTER, output latch
IC4 = avr-5:MEGA48/88/168-PU
IC5 = rbg-macetech-rtc:CHRONODOT
IC6 = linear:78*: Positive VOLTAGE REGULATOR Source: http://cache.national.com/ds/LM/LM78L05.pdf http://www.fairchildsemi.com/ds/LM/LM7805.pdf
JP1 = avr-5-4.16:AVR-ISP-6: AVR ISP-6 Serial Programming Header
LED0T78 LED-T1-LED-T77 LED-T79-LED-T112 = led:LED-2AC-: LEDs with 2 Cathode & 2 Anode - Kingbright SUPER FLUX LED LAMP Source: www.us.kingbright.com/images/catalog/SPEC/W7676CPBC-H.pdf
LED-S1-LED-S112 = led:LED: LED OSRAM: - CHIPLED LG R971, LG N971, LY N971, LG Q971, LY Q971, LO R971, LY R971 LH N974, LH R974 LS Q976, LO Q976, LY Q976 LO Q996 - Hyper CHIPLED LW Q18S LB Q993, LB Q99A, LB R99A - SideLED LS A670, LO A670, LY A670, LG A670, LP A670 LB A673, LV A673, LT A673, LW A673 LH A674 LY A675 LS A676, LA A676, LO A676, LY A676, LW A676 LS A679, LY A679, LG A679 - Hyper Micro SIDELED® LS Y876, LA Y876, LO Y876, LY Y876 LT Y87S - SmartLED LW L88C, LW L88S LB L89C, LB L89S, LG L890 LS L89K, LO L89K, LY L89K LS L896, LA L896, LO L896, LY L896 - TOPLED LS T670, LO T670, LY T670, LG T670, LP T670 LSG T670, LSP T670, LSY T670, LOP T670, LYG T670 LG T671, LOG T671, LSG T671 LB T673, LV T673, LT T673, LW T673 LH T674 LS T676, LA T676, LO T676, LY T676, LB T676, LH T676, LSB T676, LW T676 LB T67C, LV T67C, LT T67C, LS T67K, LO T67K, LY T67K, LW E67C LS E67B, LA E67B, LO E67B, LY E67B, LB E67C, LV E67C, LT E67C LW T67C LS T679, LY T679, LG T679 LS T770, LO T770, LY T770, LG T770, LP T770 LB T773, LV T773, LT T773, LW T773 LH T774 LS E675, LA E675, LY E675, LS T675 LS T776, LA T776, LO T776, LY T776, LB T776 LHGB T686 LT T68C, LB T68C - Hyper Mini TOPLED® LB M676 - Mini TOPLED Santana® LG M470 LS M47K, LO M47K, LY M47K Source: http://www.osram.convergy.de LUXEON: - LUMILED® LXK2-PW12-R00, LXK2-PW12-S00, LXK2-PW14-U00, LXK2-PW14-V00 LXK2-PM12-R00, LXK2-PM12-S00, LXK2-PM14-U00 LXK2-PE12-Q00, LXK2-PE12-R00, LXK2-PE12-S00, LXK2-PE14-T00, LXK2-PE14-U00 LXK2-PB12-K00, LXK2-PB12-L00, LXK2-PB12-M00, LXK2-PB14-N00, LXK2-PB14-P00, LXK2-PB14-Q00 LXK2-PR12-L00, LXK2-PR12-M00, LXK2-PR14-Q00, LXK2-PR14-R00 LXK2-PD12-Q00, LXK2-PD12-R00, LXK2-PD12-S00 LXK2-PH12-R00, LXK2-PH12-S00 LXK2-PL12-P00, LXK2-PL12-Q00, LXK2-PL12-R00 Source: www.luxeon.com KINGBRIGHT: KA-3528ASYC Source: www.kingbright.com
R1-R16 R19-R23 = rcl:R-US_: RESISTOR, American symbol
S1-S4 = switch-omron:31-XX: OMRON SWITCH
X1-X4 X8 X9 = rbg-generic-headers:M08-100MIL
X5 = rbg-ftdi-usb:TTL-232R-5V
X6 = rbg-cui-dcpower:PJ-002
X7 = con-molex:22-23-2031: .100" (2.54mm) Center Header - 3 Pin; MF: MOLEX; MPN: 22-23-2031; OC_FARNELL: 1462950; OC_NEWARK: 30C0862